# EAGLE schematic klbr4breakout (EAGLE 6.5.0)
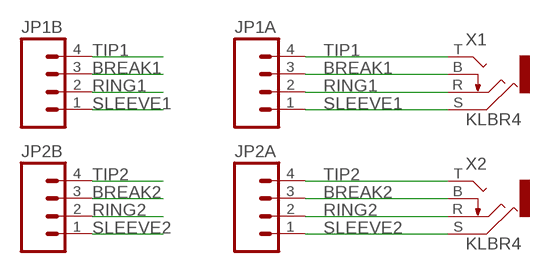
[diagram p0: schematic, sheet 1]

## Parts
JP1A  M04PTH  [1X04]
JP1B  M04PTH  [1X04]
JP2A  M04PTH  [1X04]
JP2B  M04PTH  [1X04]
X1  KLBR4  [KLBR4]
X2  KLBR4  [KLBR4]

## Nets
BREAK1: JP1A.3 JP1B.3 X1.B
BREAK2: JP2A.3 JP2B.3 X2.B
RING1: JP1A.2 JP1B.2 X1.R
RING2: JP2A.2 JP2B.2 X2.R
SLEEVE1: JP1A.1 JP1B.1 X1.S
SLEEVE2: JP2A.1 JP2B.1 X2.S
TIP1: JP1A.4 JP1B.4 X1.T
TIP2: JP2A.4 JP2B.4 X2.T

## Library data of the parts
JP1A JP1B JP2A JP2B = SparkFun-Connectors:M04: Header 4 Standard 4-pin 0.1" header. Use with straight break away headers (SKU : PRT-00116), right angle break away headers (PRT-00553), swiss pins (PRT-00743), machine pins (PRT-00117), and female headers (PRT-00115). Molex polarized connector foot print use with SKU : PRT-08231 with associated crimp pins and housings. 1MM SMD Version SKU: PRT-10208
X1 X2 = ubiyubix:KLBR4

## Net classes
0 default: width 0.61 mm